# EAGLE design 3048ONE projekt (EAGLE 9.6.2)
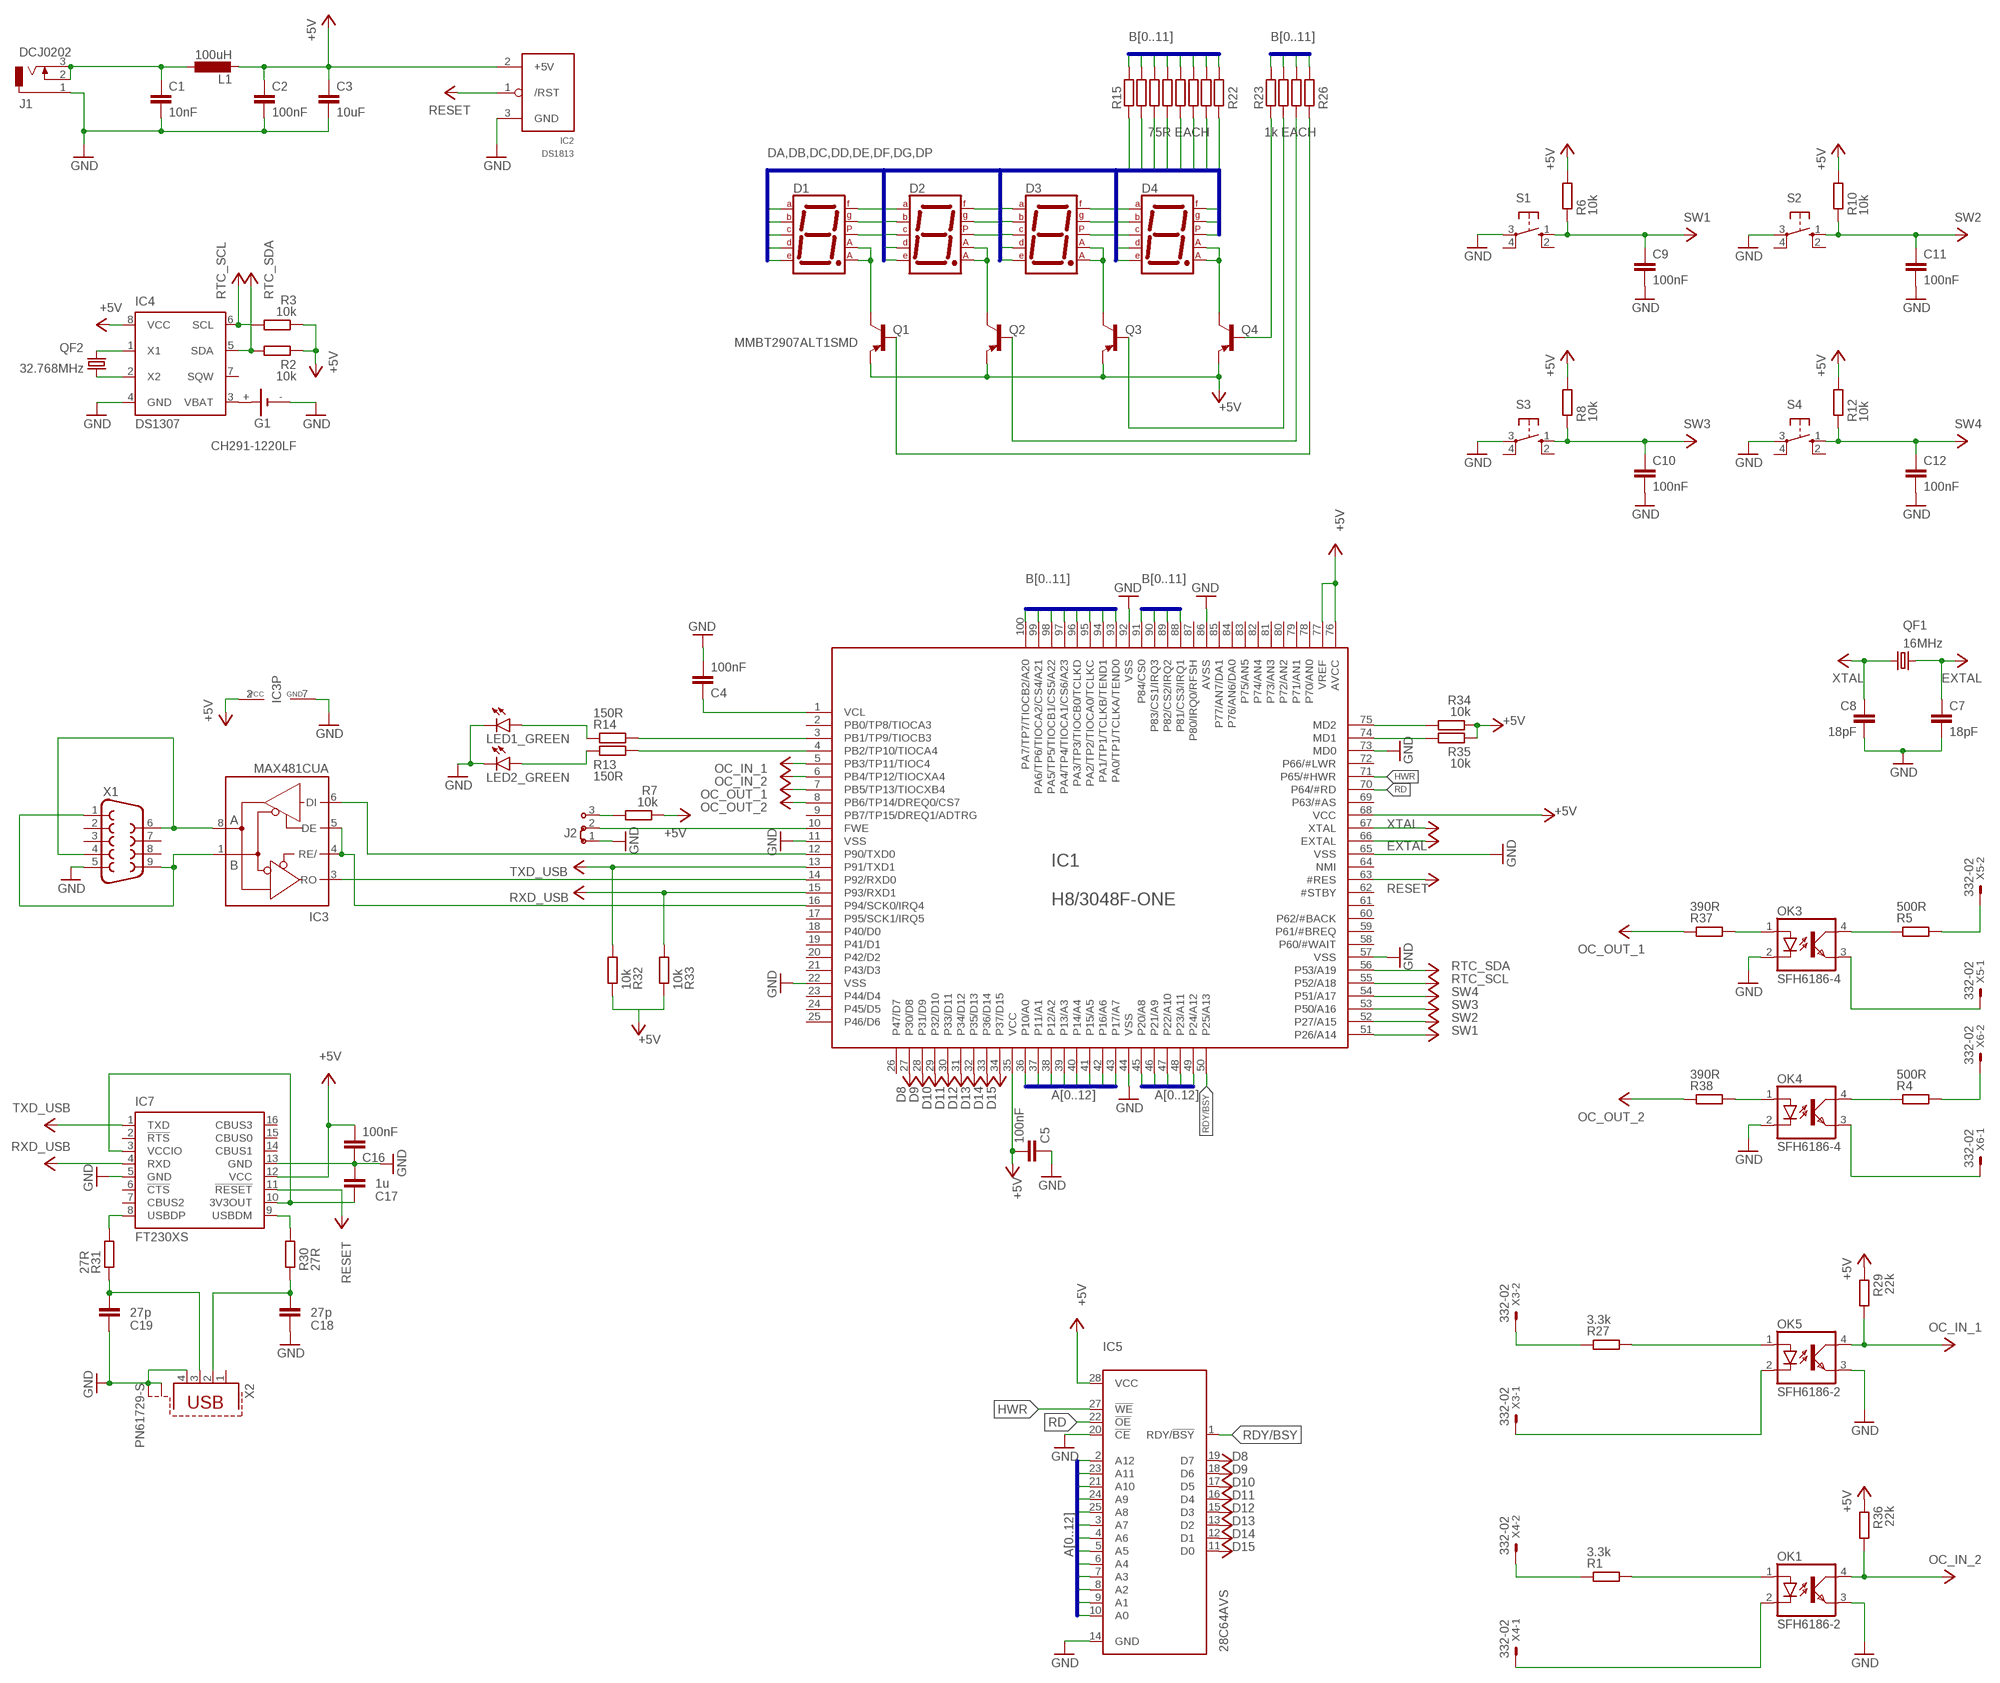
[diagram p0: schematic, sheet 1]

## Parts
C1  10nF  C-EUC0805  [C0805]
C2  100nF  C-EUC0805  [C0805]
C3  10uF  C-EUC0805  [C0805]
C4  100nF  C-EUC0805  [C0805]
C5  100nF  C-EUC0805  [C0805]
C7  18pF  C-EUC0805  [C0805]
C8  18pF  C-EUC0805  [C0805]
C9  100nF  C-EUC0805  [C0805]
C10  100nF  C-EUC0805  [C0805]
C11  100nF  C-EUC0805  [C0805]
C12  100nF  C-EUC0805  [C0805]
C16  100nF  C-EUC0805  [C0805]
C17  1u  C-EUC0805  [C0805]
C18  27p  C-EUC0805  [C0805]
C19  27p  C-EUC0805  [C0805]
D1  7SEG-CA  [7SEG-13]
D2  7SEG-CA  [7SEG-13]
D3  7SEG-CA  [7SEG-13]
D4  7SEG-CA  [7SEG-13]
G1  CH291-1220LF  [CH291-1220LF]
IC1  H8/3048F-ONE  H8/3048F  [TQFP100-16X16]
IC2  DS1813  [TO-92]
IC3  MAX481CUA  [UMAX8]
IC4  DS1307  [DIL08]
IC5  28C64AVS  [VSOP28-8X13]
IC7  FT230XS  [SSOP16]
J1  DCJ0202  [DCJ0202]
J2  J2X2MM  [04C]
L1  100uH  L-EUPIS2816  [PIS2816]
LED1_GREEN  LED3MM  [LED3MM]
LED2_GREEN  LED3MM  [LED3MM]
OK1  SFH6186-2  [SMD4-7]
OK3  SFH6186-4  [SMD4-7]
OK4  SFH6186-4  [SMD4-7]
OK5  SFH6186-2  [SMD4-7]
Q1  MMBT2907ALT1SMD  [SOT23-BEC]
Q2  MMBT2907ALT1SMD  [SOT23-BEC]
Q3  MMBT2907ALT1SMD  [SOT23-BEC]
Q4  MMBT2907ALT1SMD  [SOT23-BEC]
QF1  16MHz  CRYSTALCTS406  [CTS406]
QF2  32.768MHz  CRYSTALCTS406  [CTS406]
R1  3.3k  R-EU_M0805  [M0805]
R2  10k  R-EU_M0805  [M0805]
R3  10k  R-EU_M0805  [M0805]
R4  500R  R-EU_M0805  [M0805]
R5  500R  R-EU_M0805  [M0805]
R6  10k  R-EU_M0805  [M0805]
R7  10k  R-EU_M0805  [M0805]
R8  10k  R-EU_M0805  [M0805]
R10  10k  R-EU_M0805  [M0805]
R12  10k  R-EU_M0805  [M0805]
R13  150R  R-EU_M0805  [M0805]
R14  150R  R-EU_M0805  [M0805]
R15  150R  R-EU_M0805  [M0805]
R16  150R  R-EU_M0805  [M0805]
R17  150R  R-EU_M0805  [M0805]
R18  150R  R-EU_M0805  [M0805]
R19  150R  R-EU_M0805  [M0805]
R20  150R  R-EU_M0805  [M0805]
R21  150R  R-EU_M0805  [M0805]
R22  75R EACH  R-EU_M0805  [M0805]
R23  150R  R-EU_M0805  [M0805]
R24  150R  R-EU_M0805  [M0805]
R25  150R  R-EU_M0805  [M0805]
R26  1k EACH  R-EU_M0805  [M0805]
R27  3.3k  R-EU_M0805  [M0805]
R29  22k  R-EU_M0805  [M0805]
R30  27R  R-EU_M0805  [M0805]
R31  27R  R-EU_M0805  [M0805]
R32  10k  R-EU_M0805  [M0805]
R33  10k  R-EU_M0805  [M0805]
R34  10k  R-EU_M0805  [M0805]
R35  10k  R-EU_M0805  [M0805]
R36  22k  R-EU_M0805  [M0805]
R37  390R  R-EU_M0805  [M0805]
R38  390R  R-EU_M0805  [M0805]
S1  40-XX  [B3F-40XX]
S2  40-XX  [B3F-40XX]
S3  40-XX  [B3F-40XX]
S4  40-XX  [B3F-40XX]
X1  F09HP  [F09HP]
X2  PN61729-S  [PN61729-S]
X3  332-02  [332-02]
X4  332-02  [332-02]
X5  332-02  [332-02]
X6  332-02  [332-02]

## Nets
+5V: C2.1 C3.1 C5.2 C16.2 IC1.35(VCC) IC1.68(VCC) IC1.76(AVCC) IC1.77(VREF) IC2.2(+5V) IC3.2(VCC) IC4.8(VCC) IC5.28(VCC) IC7.12(VCC) L1.2 Q1.E Q2.E Q3.E Q4.E R2.1 R3.1 R6.2 R7.1 R8.2 R10.2 R12.2 R29.1 R34.1 R35.1 R36.1
A0: IC1.38(P12/A2) IC5.10(A0)
A1: IC1.37(P11/A1) IC5.9(A1)
A2: IC1.36(P10/A0) IC5.8(A2)
A3: IC1.49(P24/A12) IC5.7(A3)
A4: IC1.48(P23/A11) IC5.6(A4)
A5: IC1.47(P22/A10) IC5.5(A5)
A6: IC1.46(P21/A9) IC5.4(A6)
A7: IC1.45(P20/A8) IC5.3(A7)
A8: IC1.42(P16/A6) IC5.25(A8)
A9: IC1.41(P15/A5) IC5.24(A9)
A10: IC1.39(P13/A3) IC5.21(A10)
A11: IC1.40(P14/A4) IC5.23(A11)
A12: IC1.43(P17/A7) IC5.2(A12)
B0: IC1.100(PA7/TP7/TIOCB2/A20) R15.1
B1: IC1.99(PA6/TP6/TIOCA2/CS4/A21) R16.1
B2: IC1.98(PA5/TP5/TIOCB1/CS5/A22) R17.1
B3: IC1.97(PA4/TP4/TIOCA1/CS6/A23) R18.1
B4: IC1.96(PA3/TP3/TIOCB0/TCLKD) R19.1
B5: IC1.95(PA2/TP2/TIOCA0/TCLKC) R20.1
B6: IC1.94(PA1/TP1/TCLKB/TEND1) R21.1
B7: IC1.93(PA0/TP1/TCLKA/TEND0) R22.1
B8: IC1.91(P84/CS0) R23.1
B9: IC1.90(P83/CS1/IRQ3) R24.1
B10: IC1.89(P82/CS2/IRQ2) R25.1
B11: IC1.88(P81/CS3/IRQ1) R26.1
D8: IC1.27(P30/D8) IC5.19(D7)
D9: IC1.28(P31/D9) IC5.18(D6)
D10: IC1.29(P32/D10) IC5.17(D5)
D11: IC1.30(P33/D11) IC5.16(D4)
D12: IC1.31(P34/D12) IC5.15(D3)
D13: IC1.32(P35/D13) IC5.13(D2)
D14: IC1.33(P36/D14) IC5.12(D1)
D15: IC1.34(P37/D15) IC5.11(D0)
DA: D1.7(A) D2.7(A) D3.7(A) D4.7(A) R19.2
DB: D1.6(B) D2.6(B) D3.6(B) D4.6(B) R21.2
DC: D1.4(C) D2.4(C) D3.4(C) D4.4(C) R20.2
DD: D1.2(D) D2.2(D) D3.2(D) D4.2(D) R18.2
DE: D1.1(E) D2.1(E) D3.1(E) D4.1(E) R17.2
DF: D1.9(F) D2.9(F) D3.9(F) D4.9(F) R16.2
DG: D1.10(G) D2.10(G) D3.10(G) D4.10(G) R15.2
DP: D1.5(DP) D2.5(DP) D3.5(DP) D4.5(DP) R22.2
EXTAL: C7.1 IC1.66(EXTAL) QF1.3
GND: C1.2 C2.2 C3.2 C4.2 C5.1 C7.2 C8.2 C9.2 C10.2 C11.2 C12.2 C16.1 C17.2 C18.1 C19.1 G1.- IC1.11(VSS) IC1.22(VSS) IC1.44(VSS) IC1.57(VSS) IC1.65(VSS) IC1.73(MD0) IC1.86(AVSS) IC1.92(VSS) IC2.3(GND) IC3.7(GND) IC4.4(GND) IC5.14(GND) IC5.20(!CE) IC7.5(GND) IC7.13(GND) J1.1 J2.1 LED1_GREEN.K(C) LED2_GREEN.K(C) OK1.3(EMIT) OK3.2(C) OK4.2(C) OK5.3(EMIT) S1.3(P) S2.3(P) S3.3(P) S4.3(P) X1.5 X2.4 X2.S1 X2.S2
HWR: IC1.71(P65/#HWR) IC5.27(!WE)
N$1: IC1.10(FWE) J2.2
N$2: C1.1 J1.2 J1.3 L1.1
N$3: IC3.1(B) X1.1 X1.9
N$4: IC3.8(A) X1.4 X1.6
N$5: IC1.14(P92/RXD0) IC3.3(RO)
N$6: IC4.1(X1) QF2.3
N$7: IC1.12(P90/TXD0) IC3.6(DI)
N$8: IC4.2(X2) QF2.1
N$9: G1.+ IC4.3(VBAT)
N$10: OK5.2(C) X3.1
N$11: IC1.16(P94/SCK0/IRQ4) IC3.4(RE/) IC3.5(DE)
N$12: OK1.2(C) X4.1
N$13: C4.1 IC1.1(VCL)
N$14: OK3.4(COL) R5.1
N$15: OK1.1(A) R1.2
N$16: OK4.4(COL) R4.1
N$17: IC1.75(MD2) R34.2
N$18: J2.3 R7.2
N$19: IC1.74(MD1) R35.2
N$20: LED1_GREEN.A R14.1
N$21: LED2_GREEN.A R13.1
N$22: IC1.3(PB1/TP9/TIOCB3) R14.2
N$23: IC1.4(PB2/TP10/TIOCA4) R13.2
N$32: D1.3(CA1) D1.8(CA2) Q1.C
N$33: D2.3(CA1) D2.8(CA2) Q2.C
N$34: D3.3(CA1) D3.8(CA2) Q3.C
N$35: D4.3(CA1) D4.8(CA2) Q4.C
N$40: Q4.B R23.2
N$41: Q3.B R24.2
N$42: Q2.B R25.2
N$43: Q1.B R26.2
N$44: OK5.1(A) R27.2
N$47: R32.1 R33.1
N$48: IC7.9(USBDM) R30.1
N$49: C19.2 R31.1 X2.3
N$50: C18.2 R30.2 X2.2
N$51: C17.1 IC7.3(VCCIO) IC7.10(3V3OUT)
N$52: IC7.8(USBDP) R31.2
N$56: R27.1 X3.2
N$57: R1.1 X4.2
N$58: OK3.1(A) R37.2
N$60: R4.2 X6.2
N$62: OK3.3(EMIT) X5.1
N$63: OK4.1(A) R38.2
N$66: OK4.3(EMIT) X6.1
N$67: R5.2 X5.2
OC_IN_2: IC1.6(PB4/TP12/TIOCXA4) OK1.4(COL) R36.2
OC_OIN_1: IC1.5(PB3/TP11/TIOC4) OK5.4(COL) R29.2 ; supply symbol labelled OC_IN_1
OC_OUT_1: IC1.7(PB5/TP13/TIOCXB4) R37.1
OC_OUT_2: IC1.8(PB6/TP14/DREQ0/CS7) R38.1
RD: IC1.70(P64/#RD) IC5.22(!OE)
RDY/BSY: IC1.50(P25/A13) IC5.1(RDY/!BSY)
RESET: IC1.63(#RES) IC2.1(/RST) IC7.11(!RESET)
RTC_SCL: IC1.55(P52/A18) IC4.6(SCL) R3.2
RTC_SDA: IC1.56(P53/A19) IC4.5(SDA) R2.2
RXD_USB: IC1.15(P93/RXD1) IC7.4(RXD) R33.2
SW1: C9.1 IC1.51(P26/A14) R6.1 S1.1(S)
SW2: C11.1 IC1.52(P27/A15) R10.1 S2.1(S)
SW3: C10.1 IC1.53(P50/A16) R8.1 S3.1(S)
SW4: C12.1 IC1.54(P51/A17) R12.1 S4.1(S)
TXD_USB: IC1.13(P91/TXD1) IC7.1(TXD) R32.2
XTAL: C8.1 IC1.67(XTAL) QF1.1
Unconnected: IC1.2(PB0/TP8/TIOCA3) IC1.9(PB7/TP15/DREQ1/ADTRG) IC1.17(P95/SCK1/IRQ5) IC1.18(P40/D0) IC1.19(P41/D1) IC1.20(P42/D2) IC1.21(P43/D3) IC1.23(P44/D4) IC1.24(P45/D5) IC1.25(P46/D6) IC1.26(P47/D7) IC1.58(P60/#WAIT) IC1.59(P61/#BREQ) IC1.60(P62/#BACK) IC1.61 IC1.62(#STBY) IC1.64(NMI) IC1.69(P63/#AS) IC1.72(P66/#LWR) IC1.78(P70/AN0) IC1.79(P71/AN1) IC1.80(P72/AN2) IC1.81(P73/AN3) IC1.82(P74/AN4) IC1.83(P75/AN5) IC1.84(P76/AN6/DA0) IC1.85(P77/AN7/DA1) IC1.87(P80/IRQ0/RFSH) IC4.7(SQW) IC7.2(!RTS) IC7.6(!CTS) IC7.7(CBUS2) IC7.14(CBUS1) IC7.15(CBUS0) IC7.16(CBUS3) S1.2(S1) S1.4(P1) S2.2(S1) S2.4(P1) S3.2(S1) S3.4(P1) S4.2(S1) S4.4(P1) X1.2 X1.3 X1.7 X1.8 X2.1

## Buses
DA,DB,DC,DD,DE,DF,DG,DP
A[0..12]
B[0..11]

## Library data of the parts
C1-C5 C7-C12 C16-C19 = rcl:C-EU: CAPACITOR, European symbol; SPICEPREFIX: C
D1-D4 = special:7SEG-CA: 7-segment DISPLAY single anode, 13 mm
G1 = battery:CH291-1220LF: Battery Holder, SMT, 12mm multicomp PART NO. CH291-1220LF Source: Data sheet <http://www.farnell.com/datasheets/1505860.pdf>
IC1 = renesas:H8/3048F: H8/3048F in 100pin package
IC2 = ds1813_revised:DS1813
IC3 = maxim:MAX481CUA: RS485 TRANSEIVER; MPN: MAX481CUA+; OC_FARNELL: unknown; OC_NEWARK: 71P2381
IC4 = ds1307_pcf8583:DS1307: I2C-Bus CLOCK/CALENDAR
IC5 = microchip:28*64A: CMOS EEPROM 64 K (8 K x 8), low voltage; OC_FARNELL: unknown; OC_NEWARK: unknown
IC7 = ftdichip:FT230X: USB to BASIC UART IC Auto generated by make-symbol-device-package-bsdl.ulp Rev. 43 Source: Data sheet <http://www.ftdichip.com/Support/Documents/DataSheets/ICs/DS_FT230X.pdf>
J1 = con-jack:DCJ0202: DC POWER JACK Source: DCJ0202.pdf; OC_FARNELL: unknown; OC_NEWARK: unknown
J2 = jumper:J2: Jumper switch 2 x 2.5 mm
L1 = rcl:L-EU: INDUCTOR, European symbol; SPICEPREFIX: L
LED1_GREEN LED2_GREEN = led:LED: LED OSRAM: - CHIPLED LG R971, LG N971, LY N971, LG Q971, LY Q971, LO R971, LY R971 LH N974, LH R974 LS Q976, LO Q976, LY Q976 LO Q996 - Hyper CHIPLED LW Q18S LB Q993, LB Q99A, LB R99A - SideLED LS A670, LO A670, LY A670, LG A670, LP A670 LB A673, LV A673, LT A673, LW A673 LH A674 LY A675 LS A676, LA A676, LO A676, LY A676, LW A676 LS A679, LY A679, LG A679 - Hyper Micro SIDELED® LS Y876, LA Y876, LO Y876, LY Y876 LT Y87S - SmartLED LW L88C, LW L88S LB L89C, LB L89S, LG L890 LS L89K, LO L89K, LY L89K LS L896, LA L896, LO L896, LY L896 - TOPLED LS T670, LO T670, LY T670, LG T670, LP T670 LSG T670, LSP T670, LSY T670, LOP T670, LYG T670 LG T671, LOG T671, LSG T671 LB T673, LV T673, LT T673, LW T673 LH T674 LS T676, LA T676, LO T676, LY T676, LB T676, LH T676, LSB T676, LW T676 LB T67C, LV T67C, LT T67C, LS T67K, LO T67K, LY T67K, LW E67C LS E67B, LA E67B, LO E67B, LY E67B, LB E67C, LV E67C, LT E67C LW T67C LS T679, LY T679, LG T679 LS T770, LO T770, LY T770, LG T770, LP T770 LB T773, LV T773, LT T773, LW T773 LH T774 LS E675, LA E675, LY E675, LS T675 LS T776, LA T776, LO T776, LY T776, LB T776 LHGB T686 LT T68C, LB T68C - Hyper Mini TOPLED® LB M676 - Mini TOPLED Santana® LG M470 LS M47K, LO M47K, LY M47K Source: http://www.osram.convergy.de LUXEON: - LUMILED® LXK2-PW12-R00, LXK2-PW12-S00, LXK2-PW14-U00, LXK2-PW14-V00 LXK2-PM12-R00, LXK2-PM12-S00, LXK2-PM14-U00 LXK2-PE12-Q00, LXK2-PE12-R00, LXK2-PE12-S00, LXK2-PE14-T00, LXK2-PE14-U00 LXK2-PB12-K00, LXK2-PB12-L00, LXK2-PB12-M00, LXK2-PB14-N00, LXK2-PB14-P00, LXK2-PB14-Q00 LXK2-PR12-L00, LXK2-PR12-M00, LXK2-PR14-Q00, LXK2-PR14-R00 LXK2-PD12-Q00, LXK2-PD12-R00, LXK2-PD12-S00 LXK2-PH12-R00, LXK2-PH12-S00 LXK2-PL12-P00, LXK2-PL12-Q00, LXK2-PL12-R00 Source: www.luxeon.com KINGBRIGHT: KA-3528ASYC Source: www.kingbright.com
OK1 OK5 = optocoupler:SFH618?*: Optocoupler, Phototransistor Output, Low Input Current Source: Data sheet <http://www.vishay.com/docs/83673/sfh618.pdf>; MF: VISHAY/TELEFUNKEN; MPN: SFH6186-2; OC_FARNELL: 1469583; OC_NEWARK: 58K2210
OK3 OK4 = optocoupler:SFH618?*: Optocoupler, Phototransistor Output, Low Input Current Source: Data sheet <http://www.vishay.com/docs/83673/sfh618.pdf>; MF: VISHAY/TELEFUNKEN; MPN: SFH6186-4; OC_FARNELL: 1469530; OC_NEWARK: 21H7753
Q1-Q4 = transistor-pnp:MMBT2907*: PNP Transistror
QF1 QF2 = crystal:CRYSTAL: CRYSTAL; OC_FARNELL: unknown; OC_NEWARK: unknown
R1-R8 R10 R12-R27 R29-R38 = rcl:R-EU_: RESISTOR, European symbol; SPICEPREFIX: R
S1-S4 = switch-omron:40-XX: OMRON SWITCH; MF: OMRON COMPONENTS USA; MPN: B3F-4000; OC_FARNELL: 176434; OC_NEWARK: 36K3105
X1 = con-subd:F09: SUB-D; OC_FARNELL: unknown; OC_NEWARK: unknown
X2 = con-berg:PN61729-S: BERG USB connector; OC_FARNELL: unknown; OC_NEWARK: unknown
X3-X6 = con-garry:332-02: 2 Pin - 2mm Dual Row Source: www.mpe-connector.de / garry_shortform_2012.pdf

## Board
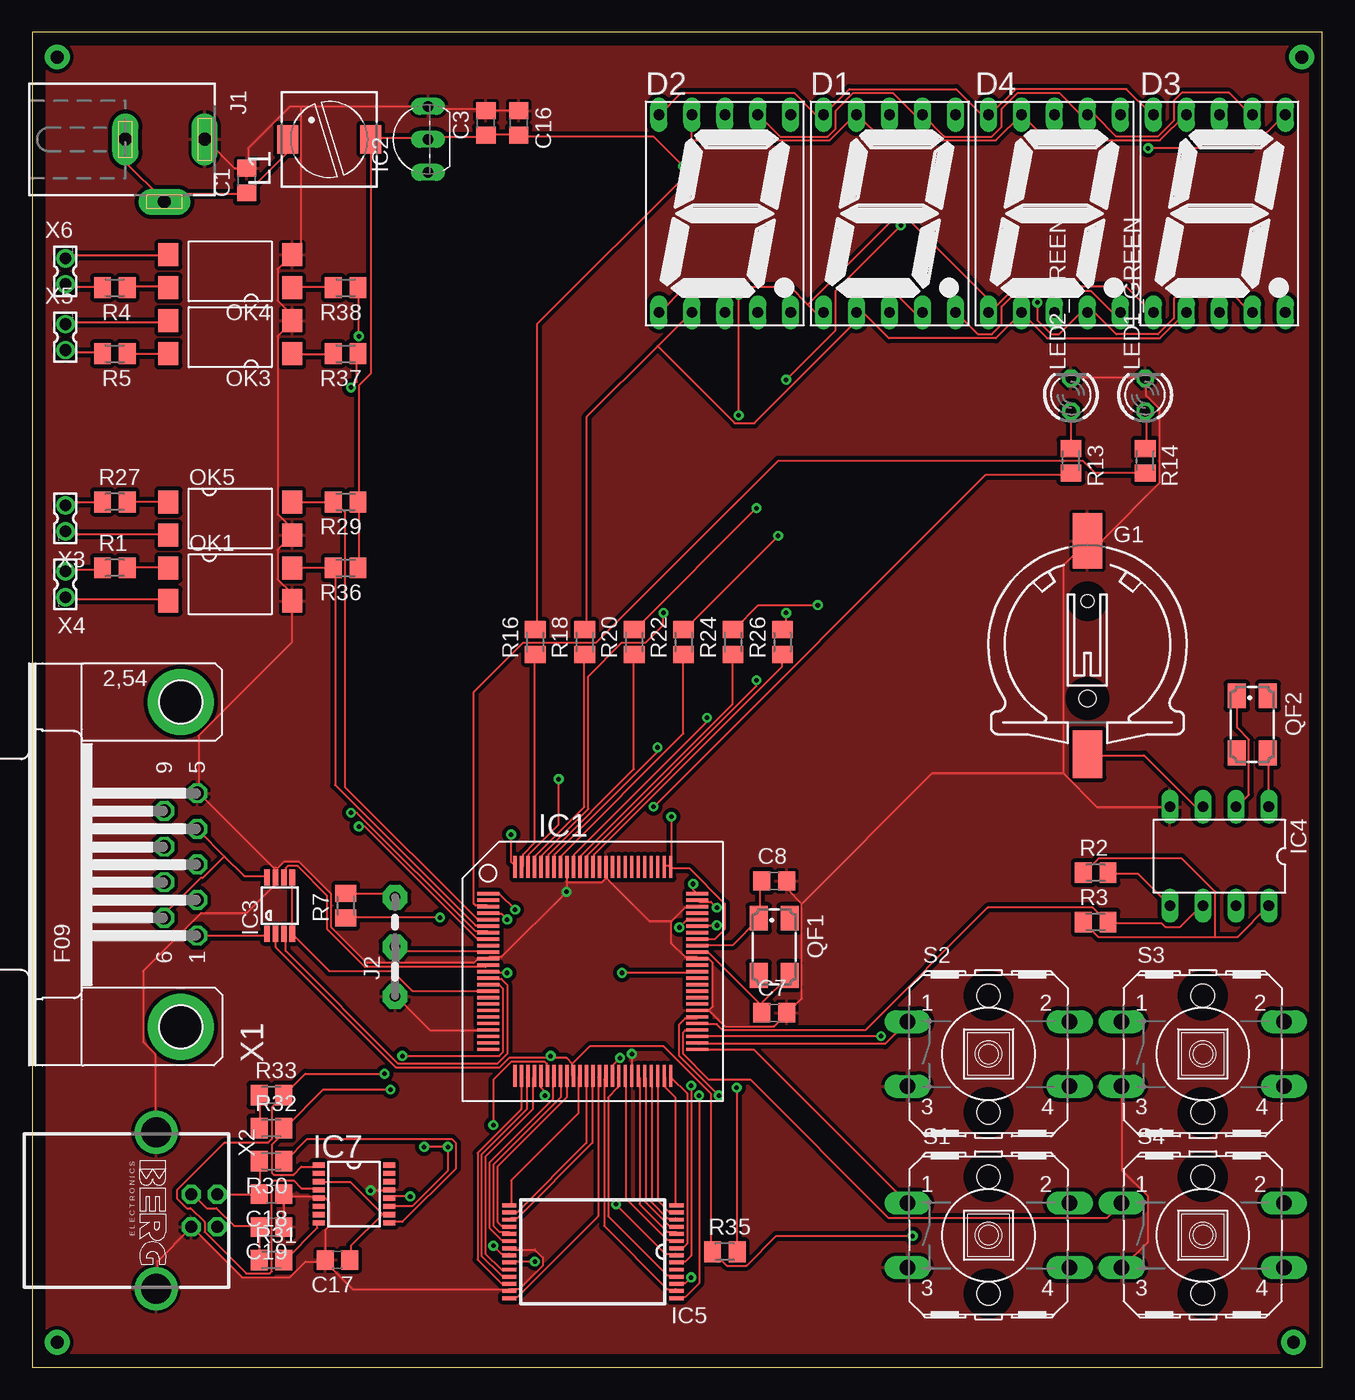
[diagram p1: board, top side]
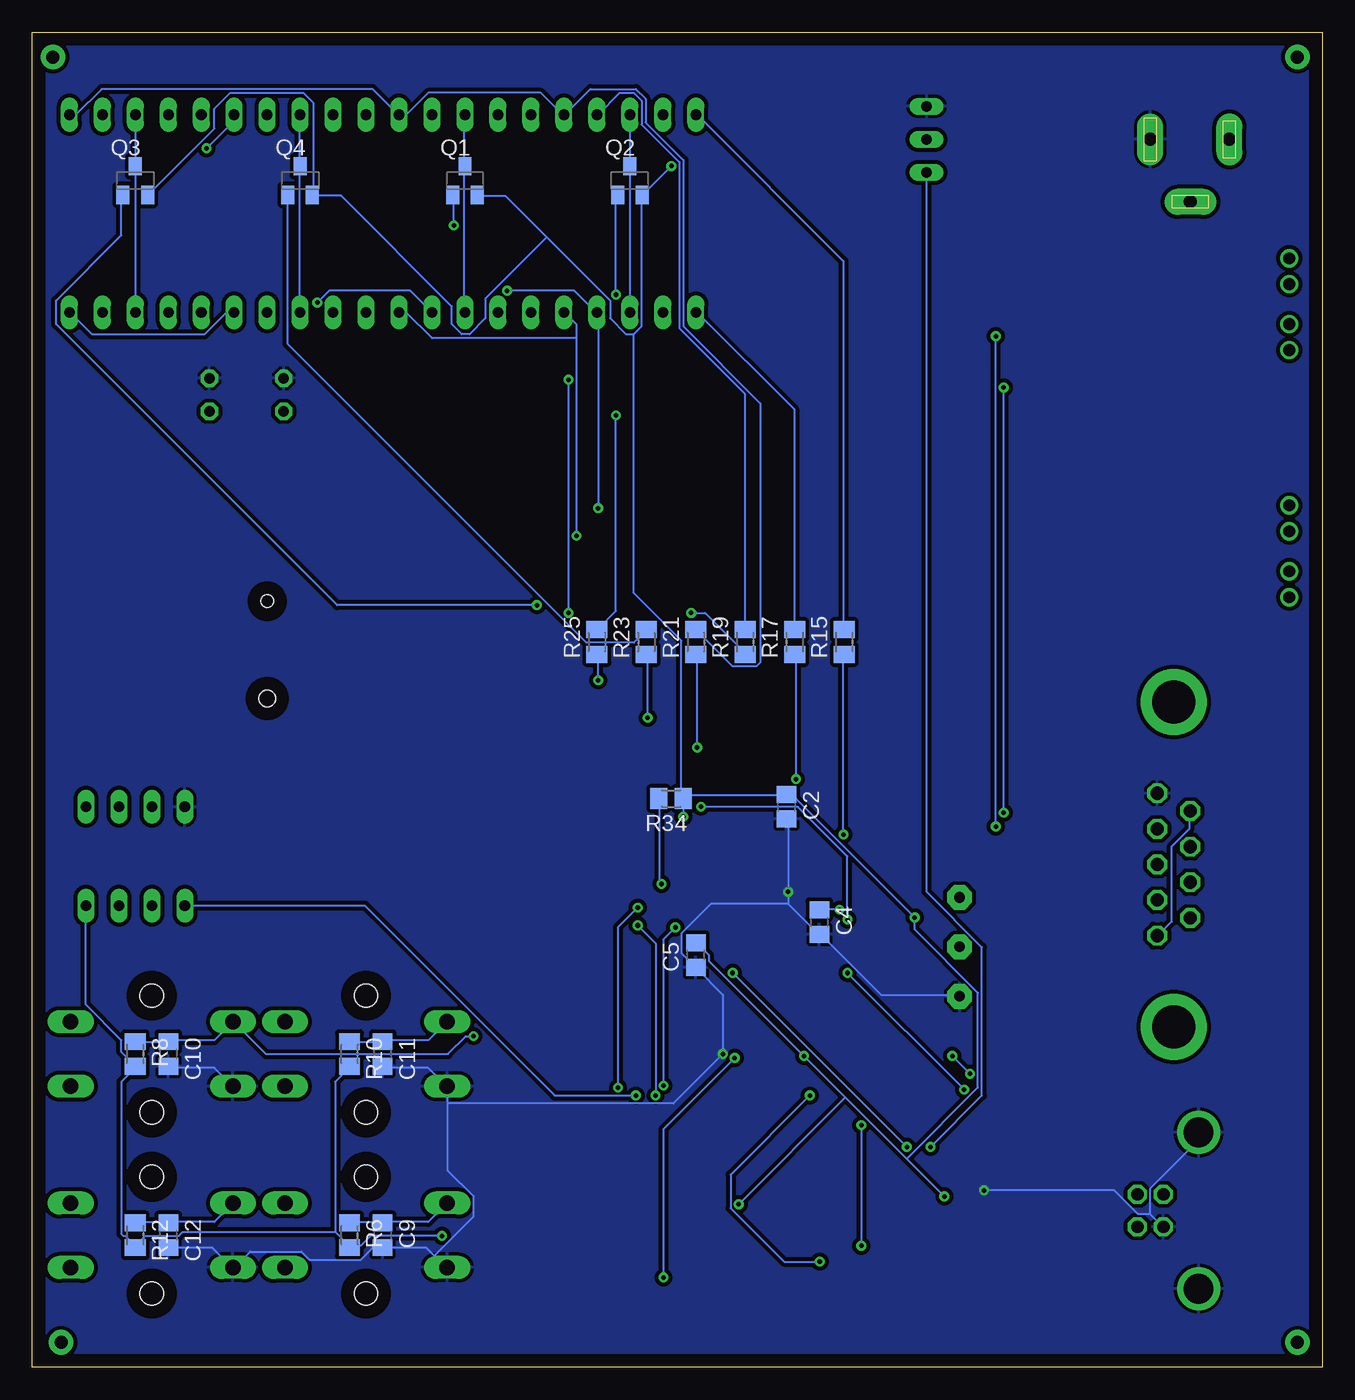
[diagram p2: board, bottom side, seen from below]

Size 99.36 x 102.86 mm. Coordinates in mm from the lower left corner, seen from the top.
Outline: 0,0 99.36,0 99.36,102.86 0,102.86 0,0
Copper layers (1*16): Top 0.035mm / dielectric 1.5mm / Bottom 0.035mm
Design rules "default": minimum track width 6mil, minimum drill 0.35mm, track to track 6mil, track to pad 6mil, pad to pad 6mil, via to via 6mil, smd to smd 6mil, copper to edge 40mil, drill to drill 6mil, minimum pad ring 10mil, minimum via ring 8mil, stop-mask expansion 4mil, vias tented up to drill 0mil, thermal gap 10mil

### Footprints (pad centres in the part's own frame; a part is rotated, then mirrored left to right if it is on the bottom)
C0805 = smd 1.3 x 1.5: 1 -0.95,0; 2 0.95,0
7SEG-13 = drill 0.813 long: 1 -5.08,-7.62; 2 -2.54,-7.62; 3 0,-7.62; 4 2.54,-7.62; 5 5.08,-7.62; 6 5.08,7.62; 7 2.54,7.62; 8 0,7.62; 9 -2.54,7.62; 10 -5.08,7.62
CH291-1220LF = smd 2.3 x 3.66: + 0,-2.296 | smd 2.3 x 4.3: - 0,14.146 | hole 1.3: 0,2 | hole 1: 0,9.5
TQFP100-16X16 = smd 0.25 x 1.7: 1 -6,-8.05; 2 -5.5,-8.05; 3 -5,-8.05; 4 -4.5,-8.05; 5 -4,-8.05; 6 -3.5,-8.05; 7 -3,-8.05; 8 -2.5,-8.05; 9 -2,-8.05; 10 -1.5,-8.05; 11 -1,-8.05; 12 -0.5,-8.05; 13 0,-8.05; 14 0.5,-8.05; 15 1,-8.05; 16 1.5,-8.05; 17 2,-8.05; 18 2.5,-8.05; 19 3,-8.05; 20 3.5,-8.05; 21 4,-8.05; 22 4.5,-8.05; 23 5,-8.05; 24 5.5,-8.05; 25 6,-8.05; 51 6,8.05; 52 5.5,8.05; 53 5,8.05; 54 4.5,8.05; 55 4,8.05; 56 3.5,8.05; 57 3,8.05; 58 2.5,8.05; 59 2,8.05; 60 1.5,8.05; 61 1,8.05; 62 0.5,8.05; 63 0,8.05; 64 -0.5,8.05; 65 -1,8.05; 66 -1.5,8.05; 67 -2,8.05; 68 -2.5,8.05; 69 -3,8.05; 70 -3.5,8.05; 71 -4,8.05; 72 -4.5,8.05; 73 -5,8.05; 74 -5.5,8.05; 75 -6,8.05 | smd 1.7 x 0.25: 26 8.05,-6; 27 8.05,-5.5; 28 8.05,-5; 29 8.05,-4.5; 30 8.05,-4; 31 8.05,-3.5; 32 8.05,-3; 33 8.05,-2.5; 34 8.05,-2; 35 8.05,-1.5; 36 8.05,-1; 37 8.05,-0.5; 38 8.05,0; 39 8.05,0.5; 40 8.05,1; 41 8.05,1.5; 42 8.05,2; 43 8.05,2.5; 44 8.05,3; 45 8.05,3.5; 46 8.05,4; 47 8.05,4.5; 48 8.05,5; 49 8.05,5.5; 50 8.05,6; 76 -8.05,6; 77 -8.05,5.5; 78 -8.05,5; 79 -8.05,4.5; 80 -8.05,4; 81 -8.05,3.5; 82 -8.05,3; 83 -8.05,2.5; 84 -8.05,2; 85 -8.05,1.5; 86 -8.05,1; 87 -8.05,0.5; 88 -8.05,0; 89 -8.05,-0.5; 90 -8.05,-1; 91 -8.05,-1.5; 92 -8.05,-2; 93 -8.05,-2.5; 94 -8.05,-3; 95 -8.05,-3.5; 96 -8.05,-4; 97 -8.05,-4.5; 98 -8.05,-5; 99 -8.05,-5.5; 100 -8.05,-6
TO-92 = drill 0.813 long: 1 -2.54,0; 2 0,0; 3 2.54,0
UMAX8 = smd 0.45 x 1.2: 1 -0.975,-2.175; 2 -0.325,-2.175; 3 0.325,-2.175; 4 0.975,-2.175; 5 0.975,2.175; 6 0.325,2.175; 7 -0.325,2.175; 8 -0.975,2.175
DIL08 = drill 0.813 long: 1 -3.81,-3.81; 2 -1.27,-3.81; 3 1.27,-3.81; 4 3.81,-3.81; 5 3.81,3.81; 6 1.27,3.81; 7 -1.27,3.81; 8 -3.81,3.81
VSOP28-8X13 = smd 0.3 x 1.1: 1 0.275,-6.45; 2 0.825,-6.45; 3 1.375,-6.45; 4 1.925,-6.45; 5 2.475,-6.45; 6 3.025,-6.45; 7 3.575,-6.45; 8 3.575,6.45; 9 3.025,6.45; 10 2.475,6.45; 11 1.925,6.45; 12 1.375,6.45; 13 0.825,6.45; 14 0.275,6.45; 15 -0.275,6.45; 16 -0.825,6.45; 17 -1.375,6.45; 18 -1.925,6.45; 19 -2.475,6.45; 20 -3.025,6.45; 21 -3.575,6.45; 22 -3.575,-6.45; 23 -3.025,-6.45; 24 -2.475,-6.45; 25 -1.925,-6.45; 26 -1.375,-6.45; 27 -0.825,-6.45; 28 -0.275,-6.45
SSOP16 = smd 0.914 x 0.406: 1 -2.718,2.223; 2 -2.718,1.587; 3 -2.718,0.953; 4 -2.718,0.318; 5 -2.718,-0.318; 6 -2.718,-0.953; 7 -2.718,-1.587; 8 -2.718,-2.223; 9 2.718,-2.223; 10 2.718,-1.587; 11 2.718,-0.953; 12 2.718,-0.318; 13 2.718,0.318; 14 2.718,0.953; 15 2.718,1.587; 16 2.718,2.223
DCJ0202 = drill 1 pad 2 long: 1 0,3.1; 2 4.8,0; 3 0,-3
04C = drill 0.813 pad 1.905 octagon: 1 -1.905,0; 2 1.905,0; 3 5.715,0
PIS2816 = smd 2.2 x 1.6: 1 0,3.2; 2 0,-3.2
LED3MM = drill 0.813 octagon: A -1.27,0; K 1.27,0
SMD4-7 = smd 1.78 x 1.55: 1 -1.27,-4.77; 2 1.27,-4.77; 3 1.27,4.77; 4 -1.27,4.77
SOT23-BEC = smd 1 x 1.4: B -0.95,-1.1; C 0,1.1; E 0.95,-1.1
CTS406 = smd 1.9 x 1.4: 1 -2.2,-1.2; 2 2.2,-1.2; 3 2.2,1.2; 4 -2.2,1.2
M0805 = smd 1.3 x 1.6: 1 -0.95,0; 2 0.95,0
B3F-40XX = drill 1.194 long: 1 -6.248,2.489; 2 6.248,2.489; 3 -6.248,-2.489; 4 6.248,-2.489 | hole 1.803: 0,-4.496; 0,4.496
F09HP = drill 1.016 octagon: 1 -5.486,-1.27; 2 -2.743,-1.27; 3 0,-1.27; 4 2.743,-1.27; 5 5.486,-1.27; 6 -4.115,1.27; 7 -1.372,1.27; 8 1.372,1.27; 9 4.115,1.27 | drill 3.302 pad 5.08: G1 -12.522,0; G2 12.522,0
PN61729-S = drill 0.95 octagon: 1 1.25,4.71; 2 -1.25,4.71; 3 -1.25,2.71; 4 1.25,2.71 | drill 2.3 pad 2.9: S1 -6.02,0; S2 6.02,0
332-02 = drill 0.9 pad 1.27: 1 0,-1; 2 0,1

### Placement (x,y rotation side)
C1  16.51,91.44 90 top
C2  41.27,43.18 270 bottom
C3  34.92,95.88 90 top
C4  38.73,34.29 270 bottom
C5  48.26,31.75 90 bottom
C7  57.15,27.3 0 top
C8  57.15,37.47 0 top
C9  72.39,10.16 270 bottom
C10  88.9,24.13 270 bottom
C11  72.39,24.13 270 bottom
C12  88.9,10.16 270 bottom
C16  37.47,95.88 270 top
C17  23.5,8.26 180 top
C18  18.41,13.33 180 top
C19  18.41,10.79 180 top
D1  66.04,88.9 0 top
D2  53.34,88.9 0 top
D3  91.44,88.9 0 top
D4  78.74,88.9 0 top
G1  81.28,49.53 0 top
IC1  43.18,30.48 270 top
IC2  30.48,94.61 90 top
IC3  19.05,35.56 0 top
IC4  91.44,39.37 180 top
IC5  43.18,8.89 90 top
IC7  24.77,13.33 0 top
J1  10.16,94.61 270 top
J2  27.94,30.48 90 top
L1  22.86,94.61 90 top
LED1_GREEN  85.72,74.93 90 top
LED2_GREEN  80.01,74.93 90 top
OK1  15.24,60.33 270 top
OK3  15.24,79.38 90 top
OK4  15.24,84.45 90 top
OK5  15.24,65.41 270 top
Q1  66.04,91.44 0 bottom
Q2  53.34,91.44 0 bottom
Q3  91.44,91.44 0 bottom
Q4  78.74,91.44 0 bottom
QF1  57.15,32.38 270 top
QF2  93.98,49.53 270 top
R1  6.35,61.6 0 top
R2  81.92,38.1 0 top
R3  81.92,34.29 0 top
R4  6.35,83.19 180 top
R5  6.35,78.1 180 top
R6  74.93,10.16 270 bottom
R7  24.13,35.56 90 top
R8  91.44,24.13 270 bottom
R10  74.93,24.13 270 bottom
R12  91.44,10.16 270 bottom
R13  80.01,69.85 270 top
R14  85.72,69.85 270 top
R15  36.83,55.88 90 bottom
R16  38.73,55.88 90 top
R17  40.64,55.88 90 bottom
R18  42.55,55.88 90 top
R19  44.45,55.88 90 bottom
R20  46.35,55.88 90 top
R21  48.26,55.88 90 bottom
R22  50.16,55.88 90 top
R23  52.07,55.88 90 bottom
R24  53.98,55.88 90 top
R25  55.88,55.88 90 bottom
R26  57.78,55.88 90 top
R27  6.35,66.67 0 top
R29  24.13,66.67 180 top
R30  18.41,15.88 180 top
R31  18.41,8.26 0 top
R32  18.41,18.41 0 top
R33  18.41,20.95 0 top
R34  50.16,43.82 180 bottom
R35  53.34,8.89 0 top
R36  24.13,61.6 180 top
R37  24.13,78.1 180 top
R38  24.13,83.19 180 top
S1  73.66,10.16 0 top
S2  73.66,24.13 0 top
S3  90.17,24.13 0 top
S4  90.17,10.16 0 top
X1  11.43,38.74 90 top
X2  9.53,12.06 270 top
X3  2.54,65.41 0 top
X4  2.54,60.33 0 top
X5  2.54,79.38 180 top
X6  2.54,84.45 180 top

### Tracks (layer width: path | path; a pad name or v marks a point on that pad's centre or on a via)
+5V  (via drill 0.35)
  Top 0.152: R36.1 25.15,61.62 25.15,66.65 R29.1 25.15,66.8 25.15,75.64 26.06,76.56 26.06,94.54 L1.2 26.06,94.69 30.48,94.69 | 30.48,94.69 30.63,94.84 34.9,94.84 C3.1 35.05,95 37.34,95 C16.2 37.49,94.84 47.85,94.84 v50.14,92.56 | 30.48,94.69 IC2.2 | IC1.77 48.77,38.61 49.07,38.61 IC1.76 | IC1.68 51.36,32.97 52.58,32.97 53.34,33.73 53.34,35.71 50.6,38.46 49.23,38.46 IC1.76 | v31.39,34.65 24.23,34.65 R7.1 | v49.23,42.42 49.23,38.61 IC1.76 | v29.11,13.16 27.58,13.16 IC7.12 | v44.96,12.55 48.77,8.74 49.53,8.74 IC5.28 | 91.14,33.12 92.81,33.12 IC4.8 | 91.14,33.12 82.14,33.12 81.08,34.19 R3.1 | 91.14,33.12 91.14,36.63 88.54,39.22 82.14,39.22 81.08,38.15 R2.1 | 39.93,23.82 41.15,23.82 41.6,23.37 | 39.93,23.82 36.73,23.82 35.97,23.06 28.04,23.06 18.75,32.36 18.75,33.27 IC3.2 | 41.6,23.37 41.6,22.45 IC1.35 | 41.6,23.37 42.98,24.74 48.62,24.74 52.27,21.08 52.27,8.89 R35.1 52.43,8.89 53.49,7.82 55.02,7.82 57.3,10.11 v67.82,10.11 | 39.93,23.82 v39.93,23.98
  Bottom 0.152: Q3.E 90.37,90.42 85.34,95.45 85.34,96.98 84.12,98.2 78.49,98.2 77.72,97.43 77.72,90.42 Q4.E 77.72,90.27 75.59,90.27 67.06,81.74 67.06,80.37 66.29,79.6 65.68,79.6 64.47,80.82 64.47,82.35 59.74,87.07 | 53.03,79.6 52.43,80.21 52.43,90.27 Q2.E 52.27,90.42 v50.14,92.56 | 53.03,79.6 53.65,79.6 54.86,80.82 54.86,82.19 59.74,87.07 | 59.74,87.07 62.94,90.27 65.08,90.27 Q1.E | R34.1 49.07,43.94 48.92,44.09 41.3,44.09 C2.1 41.15,44.09 40.84,44.09 v31.39,34.65 31.39,33.73 26.52,28.85 26.52,21.54 32,16.05 | v49.23,42.42 49.23,43.79 R34.1 | 36.73,20.78 v39.93,23.98 47.24,31.29 47.24,31.75 48.16,32.66 C5.2 | 36.73,20.78 32,16.05 | 32,16.05 v29.11,13.16 | 36.73,20.78 v44.96,12.55 | 76.05,10.41 74.98,9.35 R6.2 74.83,9.35 74.07,9.35 73.3,10.11 v67.82,10.11 | 76.05,10.41 76.05,22 74.98,23.06 R10.2 | 91.44,9.35 92.2,10.11 92.35,10.11 92.51,10.26 92.51,22 91.44,23.06 R8.2 91.44,23.22 92.51,24.28 92.51,25.2 95.25,27.94 IC4.8 | 76.05,10.41 87.78,10.41 88.09,10.11 90.68,10.11 91.44,9.35 | 91.44,9.35 R12.2 | 53.03,79.6 53.03,59.64 49.38,55.98 49.38,44.09 49.23,43.94 R34.1
A0
  Top 0.152: IC5.10 36.88,11.48 37.34,11.48 43.13,17.27 43.13,22.3 IC1.38
A1
  Top 0.152: IC5.9 36.88,11.94 37.34,11.94 42.67,17.27 42.67,22.3 IC1.37
A2
  Top 0.152: IC5.8 36.88,12.55 36.88,14.38 42.06,19.56 42.06,22.3 IC1.36
A3
  Top 0.152: IC5.7 49.53,12.55 49.53,20.78 48.77,21.54 48.77,22.3 IC1.49
A4
  Top 0.152: IC5.6 49.53,11.94 49.07,11.94 48.16,12.85 48.16,22.3 IC1.48
A5
  Top 0.152: IC5.5 49.53,11.48 48.92,11.48 47.7,12.7 47.7,22.3 IC1.47
A6
  Top 0.152: IC5.4 49.53,10.87 49.07,10.87 47.24,12.7 47.24,22.3 IC1.46
A7
  Top 0.152: IC5.3 49.53,10.41 48.92,10.41 46.79,12.55 46.79,22.3 IC1.45
A8
  Top 0.152: IC5.25 49.53,7.06 48.92,7.06 44.35,11.63 44.35,20.78 45.11,21.54 45.11,22.3 IC1.42
A9  (via drill 0.35)
  Top 0.152: v50.75,6.91 50.29,6.45 49.68,6.45 IC5.24 | v45.26,23.82 44.65,23.22 44.65,22.45 IC1.41
  Bottom 0.152: v50.75,6.91 50.75,18.34 v45.26,23.82
A10
  Top 0.152: IC5.21 36.88,5.38 37.34,5.38 43.59,11.63 43.59,22.3 IC1.39
A11
  Top 0.152: IC5.23 49.53,5.99 48.92,5.99 44.04,10.87 44.04,22.15 44.2,22.3 IC1.40
A12
  Top 0.152: IC5.2 49.53,9.8 48.92,9.8 45.72,13 45.72,22.3 IC1.43
B0  (via drill 0.35)
  Top 0.152: v36.88,41.05 36.88,38.91 37.19,38.61 IC1.100
  Bottom 0.152: v36.88,41.05 36.88,54.92 R15.1
B1
  Top 0.152: R16.1 38.71,54.92 38.71,40.44 37.8,39.52 37.8,38.61 IC1.99
B2  (via drill 0.35)
  Top 0.152: v40.54,45.31 40.54,41.81 38.25,39.52 38.25,38.61 IC1.98
  Bottom 0.152: v40.54,45.31 40.54,54.92 R17.1
B3
  Top 0.152: R18.1 42.52,54.92 42.52,43.18 38.71,39.37 38.71,38.61 IC1.97
B4  (via drill 0.35)
  Top 0.152: v48.62,58.12 48.62,57.2 47.24,55.83 45.41,55.83 42.82,53.24 42.82,43.03 39.17,39.37 39.17,38.61 IC1.96
  Bottom 0.152: v48.62,58.12 47.55,58.12 44.5,55.07 R19.1
B5
  Top 0.152: R20.1 46.33,54.92 46.33,46.08 39.78,39.52 39.78,38.61 IC1.95
B6  (via drill 0.35)
  Top 0.152: v48.16,47.75 48.16,47.45 40.23,39.52 40.23,38.61 IC1.94
  Bottom 0.152: v48.16,47.75 48.16,54.92 R21.1
B7
  Top 0.152: R22.1 50.14,54.92 50.14,48.82 40.69,39.37 40.69,38.61 IC1.93
B8  (via drill 0.35)
  Top 0.152: v51.97,50.04 51.97,49.73 41.76,39.52 41.76,38.61 IC1.91
  Bottom 0.152: v51.97,50.04 51.97,54.92 R23.1
B9
  Top 0.152: R24.1 53.95,54.92 53.95,51.11 42.22,39.37 42.22,38.61 IC1.90
B10  (via drill 0.35)
  Top 0.152: v55.78,52.93 55.78,52.48 42.67,39.37 42.67,38.61 IC1.89
  Bottom 0.152: v55.78,52.93 55.78,54.92 R25.1
B11
  Top 0.152: R26.1 57.76,54.92 57.76,54 43.28,39.52 43.28,38.61 IC1.88
D8
  Top 0.152: IC5.19 36.73,6.45 36.12,6.45 34.29,8.28 34.29,16.51 37.64,19.86 37.64,22.3 IC1.27
D9
  Top 0.152: IC5.18 36.73,7.06 36.12,7.06 34.59,8.59 34.59,16.36 38.1,19.86 38.1,22.3 IC1.28
D10
  Top 0.152: IC5.17 36.12,7.52 34.9,8.74 34.9,16.21 38.56,19.86 38.56,22.3 IC1.29
D11  (via drill 0.35)
  Top 0.152: v38.71,8.13 36.88,8.13 IC5.16 | v39.47,20.93 39.47,21.23 39.17,21.54 39.17,22.3 IC1.30
  Bottom 0.152: v38.71,8.13 41.45,8.13 45.57,12.24 45.57,14.83 v39.47,20.93
D12  (via drill 0.35)
  Top 0.152: v35.51,9.35 36.12,8.74 36.73,8.74 IC5.15 | v35.51,18.64 35.51,22.15 36.88,23.52 39.47,23.52 39.62,23.37 39.62,22.45 IC1.31
  Bottom 0.152: v35.51,18.64 v35.51,9.35
D13
  Top 0.152: IC5.13 36.73,9.8 36.12,9.8 35.2,10.72 35.2,15.75 40.08,20.62 40.08,22.3 IC1.32
D14
  Top 0.152: IC5.12 36.73,10.41 35.97,10.41 35.51,10.87 35.51,15.6 40.69,20.78 40.69,22.3 IC1.33
D15
  Top 0.152: IC5.11 36.73,10.87 36.12,10.87 35.81,11.18 35.81,15.44 41.15,20.78 41.15,22.3 IC1.34
DA
  Top 0.152: D3.7 93.88,96.52 92.2,98.2 88.54,98.2 87.94,97.59 87.94,96.06 86.72,94.84 83.52,94.84 81.84,96.52 D4.7 80.77,96.52 79.1,98.2 75.89,98.2 74.68,96.98 74.68,95.61 73.91,94.84 70.26,94.84 D1.7 67.97,96.52 66.29,98.2 63.25,98.2 61.87,96.83 61.87,95.45 61.27,94.84 57.61,94.84 55.93,96.52 D2.7
  Bottom 0.152: R19.2 44.5,56.9 44.5,75.03 49.53,80.06 49.53,92.86 52.43,95.76 52.43,97.59 53.03,98.2 54.1,98.2 55.78,96.52 D2.7
DB  (via drill 0.35)
  Top 0.152: v85.95,93.93 93.88,93.93 96.47,96.52 D3.6
  Bottom 0.152: D4.6 83.82,96.06 v85.95,93.93 | R21.2 48.16,56.74 45.41,54 43.59,54 43.28,54.3 43.28,74.27 49.23,80.21 49.23,93.02 52.12,95.91 52.12,97.74 52.88,98.5 56.39,98.5 58.37,96.52 D2.6 58.52,96.52 60.2,98.2 68.89,98.2 70.56,96.52 D1.6 71.17,96.52 73.15,98.5 94.03,98.5 96.01,96.52 D3.6
DC  (via drill 0.35)
  Top 0.152: D3.4 93.88,81.28 92.2,82.96 88.54,82.96 87.94,82.35 87.94,80.82 86.72,79.6 83.52,79.6 81.84,81.28 D4.4 80.77,81.28 79.1,79.6 78.49,79.6 77.42,80.67 v77.42,82.04 | v55.78,66.19 46.48,56.9 R20.2 | D1.4 67.97,81.28 66.29,82.96 v62.79,82.96
  Bottom 0.152: v55.78,66.19 55.78,81.28 D2.4 55.93,81.28 57.61,82.96 v62.79,82.96 | v77.42,82.04 76.5,82.96 70.26,82.96 D1.4
DD
  Top 0.152: D3.2 88.85,81.28 86.87,79.3 78.18,79.3 D4.2 74.22,79.3 65.99,79.3 64.01,81.28 D1.2 63.4,81.28 63.4,80.52 55.63,72.75 54.1,72.75 48.16,78.69 | 48.16,78.69 50.75,81.28 D2.2 | 48.16,78.69 42.67,73.2 42.67,56.9 R18.2
DE
  Top 0.152: 74.22,81.74 75.74,83.26 84.28,83.26 86.26,81.28 D3.1 | 74.22,81.74 73.76,81.28 D4.1 74.22,81.74 | D1.1 60.35,81.28 59.74,81.89 | 59.74,81.89 58.37,83.26 50.29,83.26 48.31,81.28 D2.1 | 74.22,81.74 67.36,88.59 66.45,88.59 59.74,81.89
  Bottom 0.152: R17.2 40.69,56.9 40.69,73.81 48.16,81.28 D2.1
DF
  Top 0.152: 50.75,94.54 50.75,96.52 D2.9 | 50.75,94.54 50.75,92.25 38.86,80.37 38.86,56.9 R16.2 | 50.75,94.54 61.42,94.54 63.4,96.52 D1.9 63.55,96.52 65.53,94.54 74.22,94.54 D4.9 78.18,94.54 86.87,94.54 88.85,96.52 D3.9
DG
  Top 0.152: D3.10 86.26,96.52 84.28,98.5 75.74,98.5 73.76,96.52 D4.10 73.15,96.52 71.17,98.5 62.94,98.5 D1.10 60.35,96.52 58.67,98.2 49.99,98.2 48.31,96.52 D2.10
  Bottom 0.152: R15.2 36.88,56.9 36.88,85.24 48.16,96.52 D2.10
DP  (via drill 0.35)
  Top 0.152: v57.45,64.06 50.29,56.9 R22.2 | D4.5 83.21,81.28 81.53,82.96 75.89,82.96 74.68,81.74 74.68,80.37 73.91,79.6 72.85,79.6 71.17,81.28 D1.5
  Bottom 0.152: D4.5 84.43,81.28 86.11,79.6 94.79,79.6 96.47,81.28 D3.5 | 57.45,79.3 57.45,80.37 58.37,81.28 D2.5 | 57.45,79.3 v57.45,64.06 | D1.5 70.56,81.28 68.58,79.3 57.45,79.3
EXTAL
  Top 0.152: 56.24,27.79 56.24,28.09 58.22,30.07 QF1.3 | 56.24,27.79 56.24,27.33 C7.1 56.24,27.79 | 56.24,27.79 52.12,31.9 51.36,31.9 IC1.66
GND  (via drill 0.35)
  Top 0.152: IC5.14 36.88,9.04 38.71,9.04 39.32,8.43 39.32,7.82 37.49,5.99 36.88,5.99 IC5.20 36.73,5.99 24.69,5.99 22.55,8.13 C17.2 | C17.2 22.55,8.28 22.55,10.57 22.86,10.87 22.86,12.7 22.55,13 22.1,13 IC7.5 21.95,13.16 19.66,13.16 19.51,13.31 C18.1 19.36,13.31 19.36,10.87 C19.1 | v26.06,13.61 27.43,13.61 IC7.13 | X2.S2 9.6,6.15 9.6,8.13 12.19,10.72 X2.4 12.34,10.72 16.15,6.91 19.81,6.91 21.03,8.13 22.4,8.13 C17.2 | J1.1 13.41,94.54 15.54,92.41 16.46,92.41 C1.2 16.61,92.41 16.61,93.93 19.81,97.13 20.73,97.13 | C16.1 37.34,96.83 35.05,96.83 C3.2 34.9,96.98 30.63,96.98 30.48,97.13 | 30.48,97.13 20.73,97.13 | 30.48,97.13 IC2.3 | 18.59,38.46 18.59,37.85 IC3.7 18.59,37.69 18.59,37.08 16.46,34.95 12.95,34.95 8.53,30.53 8.53,25.04 9.45,24.13 9.45,18.19 X2.S1 | 12.8,44.25 18.59,38.46 | 12.8,44.25 12.8,48.67 19.96,55.83 19.96,59.03 OK1.3 19.96,59.18 19.96,59.64 18.9,60.71 18.9,62.99 19.96,64.06 OK5.3 19.96,64.21 19.96,64.67 18.9,65.73 18.9,79.45 19.96,80.52 OK3.2 19.96,80.67 19.96,81.13 18.9,82.19 18.9,84.63 19.96,85.7 OK4.2 20.12,85.85 20.73,86.46 20.73,97.13 | 12.8,44.25 X1.5 | LED2_GREEN.K 80.01,76.25 85.65,76.25 LED1_GREEN.K 85.8,76.1 85.8,74.88 86.87,73.81 86.87,68.17 82.45,63.75 81.38,63.75 G1.- 81.23,63.6 79.4,61.77 79.4,45.77 | IC4.4 81.99,43.18 79.4,45.77 | S3.3 83.97,21.54 83.97,15.14 85.95,13.16 85.95,9.65 83.97,7.67 S4.3 | 41.15,37.39 41.15,38.46 IC1.92 | 41.15,37.39 v41.15,36.63 36.12,31.6 35.2,31.6 IC1.11 35.05,31.45 34.29,31.45 33.98,31.14 25.76,31.14 23.01,33.88 23.01,36.47 20.57,38.91 19.36,38.91 18.9,38.46 18.59,38.46 | 44.2,37.69 44.2,38.46 IC1.86 44.2,37.69
  Top 0.152: 44.2,37.69 43.89,37.39 41.15,37.39 | 52.12,27.48 53.34,26.26 57.15,26.26 58.06,27.18 C7.2 58.22,27.33 59.28,28.4 59.28,35.71 | 52.12,27.48 51.36,27.48 IC1.57 | 59.28,35.71 58.22,36.78 58.22,37.39 C8.2 | 52.12,27.48 52.43,27.79 52.43,31.14 52.12,31.45 51.36,31.45 IC1.65 51.21,31.6 50.29,31.6 49.23,32.66 49.23,34.34 | 49.23,34.34 50.29,35.41 51.21,35.41 IC1.73 | 44.2,37.69 47.55,34.34 49.23,34.34 | IC1.22 35.05,25.96 30.63,25.96 28.04,28.55 J2.1 | v46.18,24.13 46.18,22.45 IC1.44 | 79.4,45.77 69.34,45.77 59.28,35.71
  Bottom 0.152: v26.06,13.61 16,13.61 14.17,11.79 13.26,11.79 | 13.26,11.79 12.34,10.87 X2.4 | 13.26,11.79 13.26,13.77 9.6,17.42 9.6,18.03 X2.S1 | S3.3 85.34,23.06 88.85,23.06 C10.2 | C11.2 72.39,23.06 68.89,23.06 67.51,21.69 S2.3 67.36,21.54 67.36,20.32 | 72.39,9.2 69.04,9.2 68.43,8.59 | 68.43,8.59 67.51,7.67 S1.3 | C12.2 88.85,9.2 85.5,9.2 83.97,7.67 S4.3 83.82,7.67 82.6,8.89 78.64,8.89 78.03,8.28 74.07,8.28 73.15,9.2 72.39,9.2 | 72.39,9.2 C9.2 | 67.36,20.32 67.36,15.14 65.38,13.16 65.38,11.63 68.43,8.59 | 41.15,35.71 38.86,33.43 C4.2 38.71,33.43 33.98,28.7 28.04,28.7 J2.1 | 41.15,35.71 v41.15,36.63 41.15,42.11 C2.2 | 41.15,35.71 47.09,35.71 49.38,33.43 49.38,31.9 48.31,30.84 C5.1 48.16,30.68 46.18,28.7 v46.18,24.13 49.99,20.32 67.36,20.32
  pour Bottom (isolate 0.305): 0,102.87 99.06,102.87 99.06,0 0,0
  pour Top (isolate 0.305): 0,102.87 99.06,102.87 99.06,0 0,0
HWR  (via drill 0.35)
  Top 0.152: v50.75,21.69 50.75,8.59 50.29,8.13 49.68,8.13 IC5.27 | v49.84,33.88 50.44,34.49 51.21,34.49 IC1.71
  Bottom 0.152: v50.75,21.69 50.75,32.97 v49.84,33.88
N$1
  Top 0.152: IC1.10 35.05,32.05 28.35,32.05 28.04,32.36 J2.2
N$2
  Top 0.152: L1.1 19.66,94.54 19.66,93.62 16.61,90.58 C1.1 16.46,90.42 10.67,90.42 10.21,89.97 J1.2 10.06,89.97 7.16,92.86 7.16,94.54 J1.3
N$3
  Top 0.152: IC3.1 17.98,33.27 12.8,33.27 X1.1
  Bottom 0.152: X1.9 10.21,42.72 10.21,41.5 11.58,40.13 11.58,34.34 12.65,33.27 X1.1
N$4
  Top 0.152: 14.78,39.37 12.8,41.35 X1.4 | 14.78,39.37 16.31,37.85 17.98,37.85 IC3.8 | 14.78,39.37 13.11,37.69 12.95,37.69 10.21,34.95 10.21,34.65 X1.6
N$5
  Top 0.152: IC3.3 19.51,33.27 19.51,32.05 28.19,23.37 35.81,23.37 36.58,24.13 36.58,29.46 36.12,29.92 35.2,29.92 IC1.14
N$6
  Top 0.152: IC4.1 95.25,47.3 QF2.3
N$7
  Top 0.152: IC3.6 19.51,37.85 19.51,38.46 19.66,38.61 20.42,38.61 22.71,36.32 22.71,33.73 25.6,30.84 34.9,30.84 35.05,30.99 IC1.12
N$8
  Top 0.152: QF2.1 92.81,51.71 92.81,49.28 93.73,48.36 93.73,44.09 92.81,43.18 IC4.2
N$9
  Top 0.152: IC4.3 89.61,43.18 85.65,47.14 81.38,47.14 G1.+
N$10
  Top 0.152: OK5.2 10.36,64.21 2.74,64.21 2.59,64.36 X3.1
N$11
  Top 0.152: IC3.5 19.96,37.69 19.96,33.43 IC3.4 20.12,33.27 22.86,30.53 27.74,30.53 29.26,29.01 35.05,29.01 IC1.16
N$12
  Top 0.152: OK1.2 10.36,59.18 2.59,59.18 X4.1
N$13  (via drill 0.35)
  Top 0.152: v37.19,35.26 35.97,36.47 35.2,36.47 IC1.1
  Bottom 0.152: v37.19,35.26 38.71,35.26 C4.1
N$14
  Top 0.152: R5.1 7.32,78.08 10.36,78.08 OK3.4
N$15
  Top 0.152: R1.2 7.32,61.62 10.36,61.62 OK1.1
N$16
  Top 0.152: R4.1 7.32,83.26 10.36,83.26 OK4.4
N$17  (via drill 0.35)
  Top 0.152: v50.9,37.24 50.9,36.78 51.21,36.47 IC1.75
  Bottom 0.152: v50.9,37.24 51.05,37.39 51.05,43.79 R34.2
N$18
  Top 0.152: R7.2 24.23,36.47 27.74,36.47 27.89,36.32 J2.3
N$19  (via drill 0.35)
  Top 0.152: v54.25,21.54 54.25,8.89 R35.2 | v52.73,35.41 52.27,35.87 51.36,35.87 IC1.74
  Bottom 0.152: v54.25,21.54 54.25,33.88 v52.73,35.41
N$20
  Top 0.152: R14.1 85.8,70.92 85.8,73.66 LED1_GREEN.A
N$21
  Top 0.152: LED2_GREEN.A R13.1
N$22
  Top 0.152: R14.2 85.65,68.94 81.84,68.94 80.92,69.85 57.45,69.85 43.43,55.83 37.8,55.83 33.98,52.02 33.98,35.71 34.14,35.56 35.05,35.56 IC1.3
N$23  (via drill 0.35)
  Top 0.152: v47.85,43.18 73.46,68.78 80.01,68.78 R13.2 | v36.58,34.49 36.12,34.95 35.2,34.95 IC1.4
  Bottom 0.152: v47.85,43.18 40.39,43.18 36.58,39.37 v36.58,34.49
N$24  (via drill 1 pad 1.91)
  other vias: 1.91,1.91
N$25  (via drill 1 pad 1.91)
  other vias: 97.16,1.91
N$26  (via drill 1 pad 1.91)
  other vias: 1.91,100.96
N$27  (via drill 1 pad 1.91)
  other vias: 97.79,100.96
N$32
  Bottom 0.152: D1.8 66.14,96.52 66.14,92.56 Q1.C 66.14,92.41 66.14,81.28 D1.3
N$33
  Bottom 0.152: D2.8 Q2.C D2.3
N$34
  Bottom 0.152: D3.8 Q3.C D3.3
N$35
  Bottom 0.152: D4.8 78.79,96.52 78.79,92.56 Q4.C 78.79,92.41 78.79,81.28 D4.3
N$40
  Bottom 0.152: Q4.B 79.7,90.27 79.7,78.84 56.69,55.83 53.03,55.83 52.12,56.74 R23.2
N$41  (via drill 0.35)
  Top 0.152: v60.5,58.73 55.93,58.73 54.1,56.9 R24.2
  Bottom 0.152: v60.5,58.73 75.89,58.73 97.54,80.37 97.54,82.19 92.51,87.22 92.51,90.27 Q3.B
N$42  (via drill 0.35)
  Top 0.152: v54.41,73.35 v54.41,82.65
  Bottom 0.152: v54.41,82.65 54.41,90.27 Q2.B | v54.41,73.35 54.41,58.27 55.78,56.9 R25.2
N$43  (via drill 0.35)
  Top 0.152: v66.9,87.99 61.87,82.96 61.87,79.91 v58.06,76.1 | v58.06,58.12 58.06,57.05 57.91,56.9 R26.2
  Bottom 0.152: v66.9,87.99 66.9,90.27 Q1.B | v58.06,58.12 v58.06,76.1
N$44
  Top 0.152: R27.2 7.32,66.65 10.36,66.65 OK5.1
N$47
  Top 0.152: R32.1 17.53,18.49 17.53,20.93 R33.1
N$48
  Top 0.152: IC7.9 27.58,11.18 28.5,11.18 32.61,15.29 32.61,17.27 32.31,17.58 21.18,17.58 19.51,15.9 R30.1
N$49
  Top 0.152: R31.1 17.53,8.28 17.53,10.72 C19.2 17.37,10.87 15.54,10.87 14.17,12.24 13.41,12.24 12.34,13.31 X2.3
N$50
  Top 0.152: R30.2 17.53,15.75 17.53,13.46 C18.2 17.37,13.31 14.33,13.31 X2.2
N$51
  Top 0.152: 26.98,11.79 24.54,14.22 22.1,14.22 IC7.3 | 26.98,11.79 27.43,11.79 IC7.10 | 26.98,11.79 24.54,9.35 24.54,8.28 C17.1
N$52
  Top 0.152: IC7.8 21.95,11.02 21.95,10.72 19.51,8.28 R31.2
N$56
  Top 0.152: R27.1 5.33,66.65 2.74,66.65 2.59,66.5 X3.2
N$57
  Top 0.152: R1.1 5.33,61.47 2.59,61.47 X4.2
N$58
  Top 0.152: R37.2 23.16,78.08 20.12,78.08 OK3.1
N$60
  Top 0.152: R4.2 5.33,83.26 2.74,83.26 2.59,83.41 X6.2
N$62
  Top 0.152: OK3.3 10.36,80.52 2.59,80.52 X5.1
N$63
  Top 0.152: R38.2 23.16,83.26 20.12,83.26 OK4.1
N$66
  Top 0.152: OK4.3 10.36,85.7 2.74,85.7 2.59,85.55 X6.1
N$67
  Top 0.152: R5.2 5.33,78.23 2.59,78.23 X5.2
OC_IN_2
  Top 0.152: OK1.4 20.12,61.62 23.16,61.62 R36.2 23.32,61.47 23.32,44.86 34.14,34.04 35.05,34.04 IC1.6
OC_OIN_1
  Top 0.152: OK5.4 20.12,66.65 23.16,66.65 R29.2 23.32,66.65 24.08,65.89 24.08,44.7 34.29,34.49 35.05,34.49 IC1.5
OC_OUT_1  (via drill 0.35)
  Top 0.152: v24.54,75.49 24.99,75.95 24.99,78.08 R37.1 | v24.54,42.72 24.99,42.72 34.14,33.58 35.05,33.58 IC1.7
  Bottom 0.152: v24.54,42.72 v24.54,75.49
OC_OUT_2  (via drill 0.35)
  Top 0.152: v25.15,79.45 25.15,83.11 R38.1 | v25.15,41.66 25.6,41.66 34.29,32.97 35.05,32.97 IC1.8
  Bottom 0.152: v25.15,41.66 v25.15,79.45
RD  (via drill 0.35)
  Top 0.152: v51.36,20.93 51.36,6.45 50.29,5.38 49.68,5.38 IC5.22 | v52.73,34.04 51.36,34.04 IC1.70
  Bottom 0.152: v51.36,20.93 51.36,32.66 v52.73,34.04
RDY/BSY
  Top 0.152: IC5.1 49.68,9.2 50.14,9.2 50.44,9.5 50.44,21.08 49.23,22.3 IC1.50
RESET  (via drill 0.35)
  Top 0.152: v45.41,30.38 51.21,30.38 IC1.63 | IC7.11 27.58,12.39 29.26,12.39 32,15.14 v32,16.97 v30.18,16.97
  Bottom 0.152: v45.41,30.38 v32,16.97 | IC2.1 30.48,36.63 26.21,32.36 26.21,20.93 v30.18,16.97
RTC_SCL
  Top 0.152: IC4.6 90.07,35.56 88.39,33.88 87.33,33.88 87.02,34.19 82.91,34.19 R3.2 82.75,34.34 81.69,35.41 73.61,35.41 64.16,25.96 53.19,25.96 52.73,26.42 51.36,26.42 IC1.55
RTC_SDA  (via drill 0.35)
  Top 0.152: IC4.5 85.19,38 82.91,38 R2.2 | v52.88,20.93 49.84,23.98 49.84,26.42 50.29,26.87 51.21,26.87 IC1.56
  Bottom 0.152: v52.88,20.93 59.13,20.93 73.76,35.56 IC4.5
RXD_USB  (via drill 0.35)
  Top 0.152: IC7.4 21.95,13.77 20.73,13.77 20.12,14.38 18.59,14.38 18.44,14.22 18.44,7.37 18.29,7.21 16.46,7.21 13.26,10.41 13.26,11.18 12.19,12.24 11.89,12.24 11.12,13 11.12,13.61 14.78,17.27 18.14,17.27 18.44,17.58 18.44,20.02 19.36,20.93 R33.2 19.51,21.08 21.03,22.61 v27.13,22.61 | v28.5,23.98 35.97,23.98 36.27,24.28 36.27,29.16 35.97,29.46 35.2,29.46 IC1.15
  Bottom 0.152: v27.13,22.61 v28.5,23.98
SW1
  Top 0.152: S1.1 55.63,24.43 51.36,24.43 IC1.51
  Bottom 0.152: 72.39,11.18 74.83,11.18 R6.1 | 72.39,11.18 68.89,11.18 S1.1 | 72.39,11.18 C9.1
SW2
  Top 0.152: S2.1 65.68,24.89 51.36,24.89 IC1.52
  Bottom 0.152: R10.1 74.83,25.04 72.39,25.04 C11.1 72.39,25.2 68.89,25.2 67.51,26.57 S2.1
SW3  (via drill 0.35)
  Top 0.152: v65.38,25.5 51.36,25.5 IC1.53
  Bottom 0.152: R8.1 91.44,25.04 89,25.04 C10.1 88.85,25.2 85.34,25.2 S3.1 83.82,26.57 81.38,24.13 67.36,24.13 65.99,25.5 v65.38,25.5
SW4
  Top 0.152: S4.1 82.75,11.48 65.99,11.48 55.32,22.15 52.12,22.15 50.14,24.13 50.14,25.81 50.29,25.96 51.21,25.96 IC1.54
  Bottom 0.152: R12.1 91.44,11.18 89,11.18 C12.1 88.85,11.18 85.34,11.18 83.97,12.55 S4.1
TXD_USB  (via drill 0.35)
  Top 0.152: IC7.1 21.95,15.44 20.73,15.44 20.12,14.83 18.59,14.83 18.44,14.99 18.44,17.12 19.36,18.03 19.36,18.34 R32.2 19.51,18.49 22.4,21.39 v27.58,21.39 | v36.58,30.38 35.2,30.38 IC1.13
  Bottom 0.152: v27.58,21.39 v36.58,30.38
XTAL
  Top 0.152: C8.1 56.08,37.39 56.08,34.65 QF1.1 55.93,34.49 53.95,32.51 51.36,32.51 IC1.67